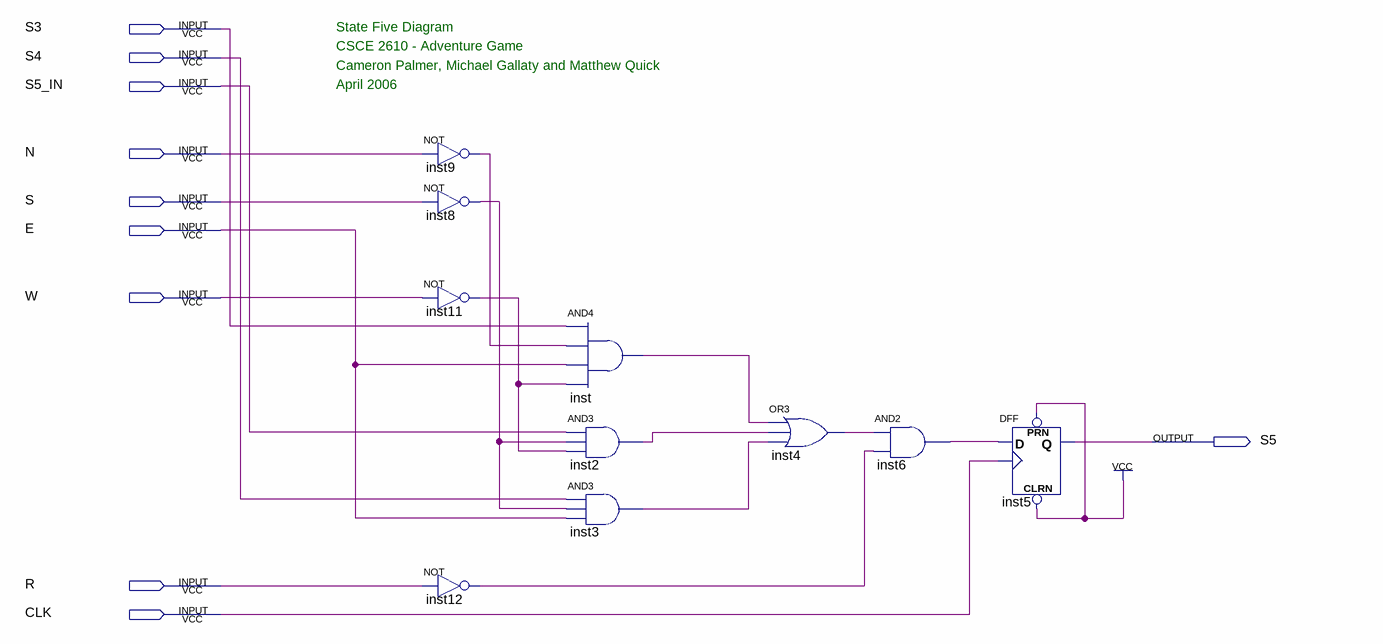
[diagram p0: schematic sheet]
// Quartus schematic state_five.bdf as structural Verilog: 10 symbols, 10 pins
module state_five (
  input  S3,
  input  S4,
  input  S5_IN,
  input  N,
  input  S,
  input  E,
  input  W,
  input  R,
  input  CLK,
  output S5
);

  wire inst2_out, inst3_out, inst4_out, inst6_out, inst8_out, inst9_out, inst11_out, inst12_out, inst_out;

  not inst9 (inst9_out, N);
  not inst8 (inst8_out, S);
  not inst11 (inst11_out, W);
  not inst12 (inst12_out, R);
  and inst (inst_out, S3, inst9_out, E, inst11_out);
  and inst2 (inst2_out, S5_IN, inst8_out, inst11_out);
  and inst3 (inst3_out, S4, inst8_out, E);
  or inst4 (inst4_out, inst_out, inst2_out, inst3_out);
  and inst6 (inst6_out, inst4_out, inst12_out);
  DFF inst5 (.CLRN(1'b1), .CLK(CLK), .D(inst6_out), .PRN(1'b1), .Q(S5));

  // Notes on the sheet:
  //   State Five Diagram
  //   CSCE 2610 - Adventure Game
  //   Cameron Palmer, Michael Gallaty and Matthew Quick
  //   April 2006
endmodule
